# EAGLE design HammondWizard (EAGLE 9.5.2)
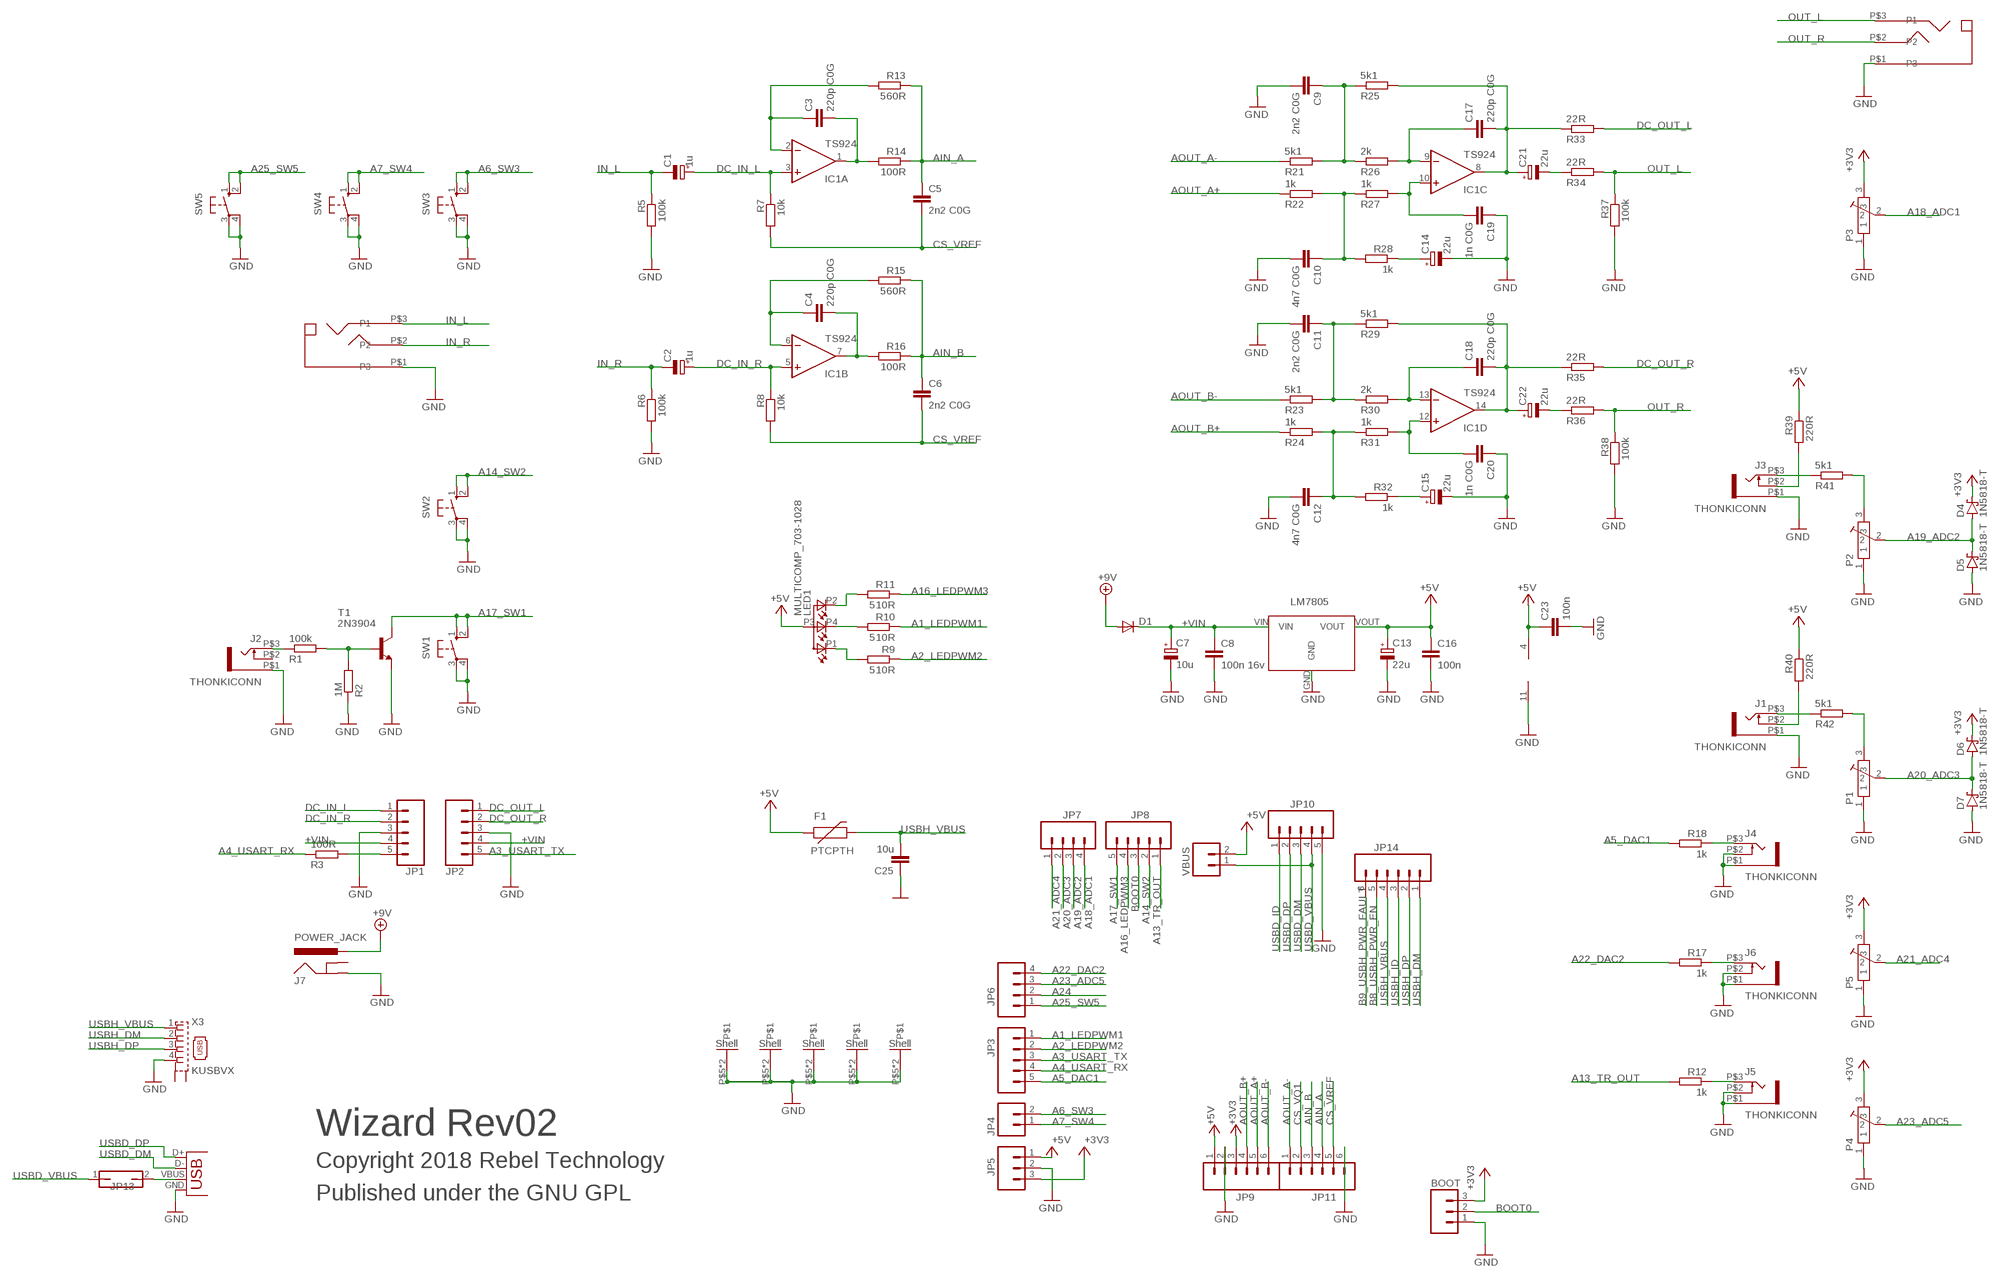
[diagram p0: schematic, sheet 1]

## Parts
BOOT  M03PTH  [1X03]
C1  1u  CPOL-EUE5-6  [E5-6]
C2  1u  CPOL-EUE5-6  [E5-6]
C3  220p C0G  C-EU050-024X044  [C050-024X044]
C4  220p C0G  C-EU050-024X044  [C050-024X044]
C5  2n2 C0G  C-EU050-024X044  [C050-024X044]
C6  2n2 C0G  C-EU050-024X044  [C050-024X044]
C7  10u  CPOL-EUE5-6  [E5-6]
C8  100n 16v  C-EU050-024X044  [C050-024X044]
C9  2n2 C0G  C-EU050-024X044  [C050-024X044]
C10  4n7 C0G  C-EU050-024X044  [C050-024X044]
C11  2n2 C0G  C-EU050-024X044  [C050-024X044]
C12  4n7 C0G  C-EU050-024X044  [C050-024X044]
C13  22u  CPOL-EUE5-6  [E5-6]
C14  22u  CPOL-EUE5-6  [E5-6]
C15  22u  CPOL-EUE5-6  [E5-6]
C16  100n  C-EU050-024X044  [C050-024X044]
C17  220p C0G  C-EU050-024X044  [C050-024X044]
C18  220p C0G  C-EU050-024X044  [C050-024X044]
C19  1n C0G  C-EU050-024X044  [C050-024X044]
C20  1n C0G  C-EU050-024X044  [C050-024X044]
C21  22u  CPOL-EUE5-6  [E5-6]
C22  22u  CPOL-EUE5-6  [E5-6]
C23  100n  C-EU050-024X044  [C050-024X044]
C25  10u  C-EU050-024X044  [C050-024X044]
D1  DIODE1N4001  [DIODE-1N4001]
D4  1N5818-T  [DO41-7.6]
D5  1N5818-T  [DO41-7.6]
D6  1N5818-T  [DO41-7.6]
D7  1N5818-T  [DO41-7.6]
F1  PTCPTH  [PTC]
IC1  TS924  LM324N  [DIL14]
J1  THONKICONN  [THONKICONN]
J2  THONKICONN  [THONKICONN]
J3  THONKICONN  [THONKICONN]
J4  THONKICONN  [THONKICONN]
J5  THONKICONN  [THONKICONN]
J6  THONKICONN  [THONKICONN]
J7  POWER_JACK  [DC_JACK_SLOT]
JP1  CONN_05JST-VERT  [JST-5-PTH-VERT]
JP2  CONN_05JST-VERT  [JST-5-PTH-VERT]
JP3  M05PTH  [1X05]
JP4  M02PTH  [1X02]
JP5  M03PTH  [1X03]
JP6  M04PTH  [1X04]
JP7  M04PTH  [1X04]
JP8  M05PTH  [1X05]
JP9  M06SIP  [1X06]
JP10  M05PTH  [1X05]
JP11  M06SIP  [1X06]
JP13  JP1Q  [JP1]
JP14  M06SIP  [1X06]
LED1  MULTICOMP_703-1028  [RGB-LED-703-1028]
P1  POT-ALPS-RK09L1140  [POT-ALPS-RK09L1140]
P2  POT-ALPS-RK09L1140  [POT-ALPS-RK09L1140]
P3  POT-ALPS-RK09L1140  [POT-ALPS-RK09L1140]
P4  POT-ALPS-RK09L1140  [POT-ALPS-RK09L1140]
P5  POT-ALPS-RK09L1140  [POT-ALPS-RK09L1140]
R1  100k  R-EU_0204/7  [0204/7]
R2  1M  R-EU_0204/7  [0204/7]
R3  100R  R-EU_0204/7  [0204/7]
R5  100k  R-EU_0204/7  [0204/7]
R6  100k  R-EU_0204/7  [0204/7]
R7  10k  R-EU_0204/7  [0204/7]
R8  10k  R-EU_0204/7  [0204/7]
R9  510R  R-EU_0204/7  [0204/7]
R10  510R  R-EU_0204/7  [0204/7]
R11  510R  R-EU_0204/7  [0204/7]
R12  1k  R-EU_0204/7  [0204/7]
R13  560R  R-EU_0204/7  [0204/7]
R14  100R  R-EU_0204/7  [0204/7]
R15  560R  R-EU_0204/7  [0204/7]
R16  100R  R-EU_0204/7  [0204/7]
R17  1k  R-EU_0204/7  [0204/7]
R18  1k  R-EU_0204/7  [0204/7]
R21  5k1  R-EU_0204/7  [0204/7]
R22  1k  R-EU_0204/7  [0204/7]
R23  5k1  R-EU_0204/7  [0204/7]
R24  1k  R-EU_0204/7  [0204/7]
R25  5k1  R-EU_0204/7  [0204/7]
R26  2k  R-EU_0204/7  [0204/7]
R27  1k  R-EU_0204/7  [0204/7]
R28  1k  R-EU_0204/7  [0204/7]
R29  5k1  R-EU_0204/7  [0204/7]
R30  2k  R-EU_0204/7  [0204/7]
R31  1k  R-EU_0204/7  [0204/7]
R32  1k  R-EU_0204/7  [0204/7]
R33  22R  R-EU_0204/7  [0204/7]
R34  22R  R-EU_0204/7  [0204/7]
R35  22R  R-EU_0204/7  [0204/7]
R36  22R  R-EU_0204/7  [0204/7]
R37  100k  R-EU_0204/7  [0204/7]
R38  100k  R-EU_0204/7  [0204/7]
R39  220R  R-EU_0204/7  [0204/7]
R40  220R  R-EU_0204/7  [0204/7]
R41  5k1  R-EU_0204/7  [0204/7]
R42  5k1  R-EU_0204/7  [0204/7]
SW1  10-XX  [B3F-10XX]
SW2  10-XX  [B3F-10XX]
SW3  10-XX  [B3F-10XX]
SW4  10-XX  [B3F-10XX]
SW5  10-XX  [B3F-10XX]
T1  2N3904  [TO92]
U2  LM7805  REG_S9V11F5  [REG_S9V11F5]
U$4  THONKICONN_STEREO  [THONKICONN_STEREO]
U$5  THONKICONN_STEREO  [THONKICONN_STEREO]
VBUS  M02PTH  [1X02]
X3  KUSBVX  [KUSBVX]
X5  USBPTH-VERTICAL  [USB-B-PTH-VERTICAL]

## Nets
+3V3: BOOT.3 D4.C D6.C JP5.3 JP9.3 P3.3 P4.3 P5.3
+5V: C13.+ C16.1 C23.1 F1.P$1 IC1.4(P:V+) JP5.1 JP9.1 LED1.P3(A) R39.1 R40.1 U2.VOUT VBUS.2
+9V: D1.A J7.PWR
+VIN: C7.+ C8.1 D1.C JP1.4 JP2.4 U2.VIN
A1_LEDPWM1: JP3.1 R10.1
A2_LEDPWM2: JP3.2 R9.1
A3_USART_TX: JP2.5 JP3.3
A4_USART_RX: JP3.4 R3.1
A5_DAC1: JP3.5 R18.2
A6_SW3: JP4.2 SW3.1(S) SW3.2(S1)
A7_SW4: JP4.1 SW4.1(S) SW4.2(S1)
A13_TR_OUT: JP8.1 R12.2
A14_SW2: JP8.2 SW2.1(S) SW2.2(S1)
A16_LEDPWM3: JP8.4 R11.1
A17_SW1: JP8.5 SW1.1(S) SW1.2(S1) T1.1(C)
A18_ADC1: JP7.4 P3.2
A19_ADC2: D4.A D5.C JP7.3 P2.2
A20_ADC3: D6.A D7.C JP7.2 P1.2
A21_ADC4: JP7.1 P5.2
A22_DAC2: JP6.4 R17.2
A23_ADC5: JP6.3 P4.2
A24: JP6.2
A25_SW5: JP6.1 SW5.1(S) SW5.2(S1)
AIN_A: C5.1 JP11.4 R13.1 R14.1
AIN_B: C6.1 JP11.3 R15.1 R16.1
AOUT_A+: JP9.5 R22.1
AOUT_A-: JP11.1 R21.1
AOUT_B+: JP9.4 R24.1
AOUT_B-: JP9.6 R23.1
B8_USBH_PWR_EN: JP14.5
B9_USBH_PWR_FAULT: JP14.6
BOOT0: BOOT.2 JP8.3
CS_VQ1: JP11.2
CS_VREF: C5.2 C6.2 JP11.5 R7.2 R8.2
DC_IN_L: C1.+ IC1.3(A:+IN) JP1.1 R7.1
DC_IN_R: C2.+ IC1.5(B:+IN) JP1.2 R8.1
DC_OUT_L: JP2.1 R33.2
DC_OUT_R: JP2.2 R35.2
GND: BOOT.1 C7.- C8.2 C9.2 C10.2 C11.2 C12.2 C13.- C14.- C15.- C16.2 C19.1 C20.1 C23.2 C25.1 D5.A D7.A IC1.11(P:V-) J1.P$1 J2.P$1 J3.P$1 J4.P$1 J4.P$2 J5.P$1 J5.P$2 J6.P$1 J6.P$2 J7.GND JP1.3 JP2.3 JP5.2 JP9.2 JP10.5 JP11.6 P1.1 P1.P$5 P1.P$6 P2.1 P2.P$5 P2.P$6 P3.1 P3.P$5 P3.P$6 P4.1 P4.P$5 P4.P$6 P5.1 P5.P$5 P5.P$6 R2.1 R5.2 R6.2 R37.2 R38.2 SW1.3(P) SW1.4(P1) SW2.3(P) SW2.4(P1) SW3.3(P) SW3.4(P1) SW4.3(P) SW4.4(P1) SW5.3(P) SW5.4(P1) T1.3(E) U2.GND U$4.P$1(P3) U$5.P$1(P3) X3.4 X5.GND
IN_L: C1.- R5.1 U$4.P$3(P1)
IN_R: C2.- R6.1 U$4.P$2(P2)
N$1: JP1.5 R3.2
N$2: J1.P$2 R40.2
N$3: C3.1 IC1.2(A:-IN) R13.2
N$4: C4.2 IC1.7(B:OUT) R16.2
N$5: C4.1 IC1.6(B:-IN) R15.2
N$6: C3.2 IC1.1(A:OUT) R14.2
N$7: C17.1 IC1.9(C:-IN) R26.2
N$8: C15.+ R32.1
N$9: C21.- R34.1
N$10: C14.+ R28.1
N$11: C19.2 IC1.10(C:+IN) R27.2
N$12: C18.2 C22.+ IC1.14(D:OUT) R29.2 R35.1
N$13: C22.- R36.1
N$14: LED1.P2(CGREEN) R11.2
N$15: C10.1 R22.2 R27.1 R28.2
N$16: LED1.P1(CRED) R9.2
N$17: LED1.P4(CBLUE) R10.2
N$18: JP13.2 X5.VBUS
N$19: J5.P$3 R12.1
N$20: J6.P$3 R17.1
N$21: J4.P$3 R18.1
N$22: J2.P$3 R1.1
N$23: J3.P$2 R39.2
N$24: C11.1 R23.2 R29.1 R30.1
N$25: P2.3 R41.2
N$26: C18.1 IC1.13(D:-IN) R30.2
N$27: J3.P$3 R41.1
N$30: C20.2 IC1.12(D:+IN) R31.2
N$31: P1.3 R42.2
N$32: C12.1 R24.2 R31.1 R32.2
N$33: J1.P$3 R42.1
N$37: R1.2 R2.2 T1.2(B)
N$39: C17.2 C21.+ IC1.8(C:OUT) R25.2 R33.1
N$41: C9.1 R21.2 R25.1 R26.1
OUT_L: R34.2 R37.1 U$5.P$3(P1)
OUT_R: R36.2 R38.1 U$5.P$2(P2)
USBD_DM: JP10.3 X5.D-
USBD_DP: JP10.2 X5.D+
USBD_ID: JP10.1
USBD_VBUS: JP10.4 JP13.1 VBUS.1
USBH_DM: JP14.1 X3.2
USBH_DP: JP14.2 X3.3
USBH_ID: JP14.3
USBH_VBUS: C25.2 F1.P$2 JP14.4 X3.1
Unconnected: J2.P$2 J7.GNDBREAK X3.M1(S1) X3.M2(S2)

## Notes on the sheet
- Wizard Rev02
- Copyright 2018 Rebel Technology
- Published under the GNU GPL

## Library data of the parts
BOOT JP5 = SparkFun:M03: Header 3 Standard 3-pin 0.1" header. Use with straight break away headers (SKU : PRT-00116), right angle break away headers (PRT-00553), swiss pins (PRT-00743), machine pins (PRT-00117), and female headers (PRT-00115). Molex polarized connector foot print use with SKU : PRT-08232 with associated crimp pins and housings.
C1 C2 C7 C13-C15 C21 C22 = Rebel:CPOL-EU: POLARIZED CAPACITOR, European symbol
C3-C6 C9-C12 C17-C20 C23 C25 = resistor:C-EU: CAPACITOR, European symbol
C8 C16 = Rebel:C-EU: CAPACITOR, European symbol
D1 = Rebel:DIODE: Diode These are standard reverse protection diodes and small signal diodes. SMA package can handle up to about 1A. SOD-323 can handle about 200mA. Watch the SOD-323 package when ordering, there are some mfgs out there that are 5-pin packages.
D4-D7 = diode:1N581*: 1.0A SCHOTTKY BARRIER RECTIFIER Source: http://www.diodes.com/datasheets/ds23001.pdf
F1 = Rebel:PTC: Resettable Fuse PTC Resettable Fuse. Bourns MF-R, Raychem PolySwitch RXE.
IC1 = linear:LM324: OP AMP
J1-J6 = Rebel:THONKICONN
J7 = Rebel:POWER_JACK: Power Jack This is the standard 5.5mm barrel jack for power. The PTH is the most common, proven, reliable, footprint. All others are experimental. The Slot footprint only works if the mill layer is transmitted to the PCB fab house so be warned. Spark Fun Electronics SKU : PRT-00119. Mating wall wart : TOL-00298 (and others)
JP1 JP2 = SparkFun-Connectors:CONN_05: Multi connection point. Often used as Generic Header-pin footprint for 0.1 inch spaced/style header connections On any of the 0.1 inch spaced packages, you can populate with these: Break Away Headers - Straight <https://www.sparkfun.com/products/116> (PRT-00116) Break Away Male Headers - Right Angle <https://www.sparkfun.com/products/553> (PRT-00553) Female Headers <https://www.sparkfun.com/products/115> (PRT-00115) Break Away Headers - Machine Pin <https://www.sparkfun.com/products/117> (PRT-00117) Break Away Female Headers - Swiss Machine Pin <https://www.sparkfun.com/products/743> (PRT-00743) For SCREWTERMINALS and SPRING TERMINALS visit here: Screw Terimnals on SparkFun.com <https://www.sparkfun.com/search/results?term=Screw+Terminals> (5mm/3.5mm/2.54mm spacing) This device is also useful as a general connection point to wire up your design to another part of your project. Our various solder wires solder well into these plated through hole pads. Hook-Up Wire - Assortment (Stranded, 22 AWG) <https://www.sparkfun.com/products/11375> (PRT-11375) Hook-Up Wire - Assortment (Solid Core, 22 AWG) <https://www.sparkfun.com/products/11367> (PRT-11367) View the entire wire category on our website here <https://www.sparkfun.com/categories/141> Special notes: Molex polarized connector foot print use with SKU : PRT-08231 with associated crimp pins and housings. 1MM SMD Version SKU: PRT-10208
JP3 JP8 JP10 = SparkFun:M05: Header 5 Standard 5-pin 0.1" header. Use with straight break away headers (SKU : PRT-00116), right angle break away headers (PRT-00553), swiss pins (PRT-00743), machine pins (PRT-00117), and female headers (PRT-00115). Molex polarized connector foot print use with SKU : PRT-08230 with associated crimp pins and housings.
JP4 VBUS = SparkFun:M02: Header 2 Standard 2-pin 0.1" header. Use with straight break away headers (SKU : PRT-00116), right angle break away headers (PRT-00553), swiss pins (PRT-00743), machine pins (PRT-00117), and female headers (PRT-00115). Molex polarized connector foot print use with SKU : PRT-08233 with associated crimp pins and housings.
JP6 JP7 = SparkFun:M04: Header 4 Standard 4-pin 0.1" header. Use with straight break away headers (SKU : PRT-00116), right angle break away headers (PRT-00553), swiss pins (PRT-00743), machine pins (PRT-00117), and female headers (PRT-00115). Molex polarized connector foot print use with SKU : PRT-08231 with associated crimp pins and housings. 1MM SMD Version SKU: PRT-10208
JP9 JP11 JP14 = SparkFun:M06: Header 6 Standard 6-pin 0.1" header. Use with straight break away headers (SKU : PRT-00116), right angle break away headers (PRT-00553), swiss pins (PRT-00743), machine pins (PRT-00117), and female headers (PRT-00115). Molex polarized connector foot print use with SKU : PRT-08094 with associated crimp pins and housings. NOTES ON THE VARIANTS LOCK and LOCK_LONGPADS... This footprint was designed to help hold the alignment of a through-hole component (i.e. 6-pin header) while soldering it into place. You may notice that each hole has been shifted either up or down by 0.005 of an inch from it's more standard position (which is a perfectly straight line). This slight alteration caused the pins (the squares in the middle) to touch the edges of the holes. Because they are alternating, it causes a "brace" to hold the component in place. 0.005 has proven to be the perfect amount of "off-center" position when using our standard breakaway headers. Although looks a little odd when you look at the bare footprint, once you have a header in there, the alteration is very hard to notice. Also, if you push a header all the way into place, it is covered up entirely on the bottom side. This idea of altering the position of holes to aid alignment will be further integrated into the Sparkfun Library for other footprints. It can help hold any component with 3 or more connection pins.
JP13 = jumper:JP1Q: JUMPER
LED1 = Rebel:MULTICOMP_703-1028: Farnell: 2112143
P1-P5 = Rebel:POT-ALPS-RK09L
R1-R3 R5-R18 R21-R42 = Rebel:R-EU_: RESISTOR, European symbol
SW1-SW5 = switch-omron:10-XX: OMRON SWITCH; MPN: B3F-1000; OC_FARNELL: 176432; OC_NEWARK: 36M3542
T1 = transistor-npn:2N3904: NPN Transistor
U2 = Rebel:REG_S9V11F5
U$4 U$5 = Rebel:THONKICONN_STEREO
X3 = con-kycon:KUSBVX: Vertical,Top Entry Universal Serial Bus Connector KUSBVX Series Source: KYCON Sibalco USB vertical socket KUSBV.pdf
X5 = SparkFun:USB: USB Connectors USB-B-PTH is fully proven SKU : PRT-00139 USB-miniB is fully proven SKU : PRT-00587 USB-A-PCB is untested. USB-A-H is throughly reviewed, but untested. Spark Fun Electronics SKU : PRT-00437 USB-B-SMT is throughly reviewed, but untested. Needs silkscreen touching up. USB-A-S has not been used/tested USB-MB-H has not been used/tested

## Net classes
1 power: width 0.178 mm, drill 0.305 mm, clearance 0.178 mm to class 0, clearance 0.178 mm

## Board
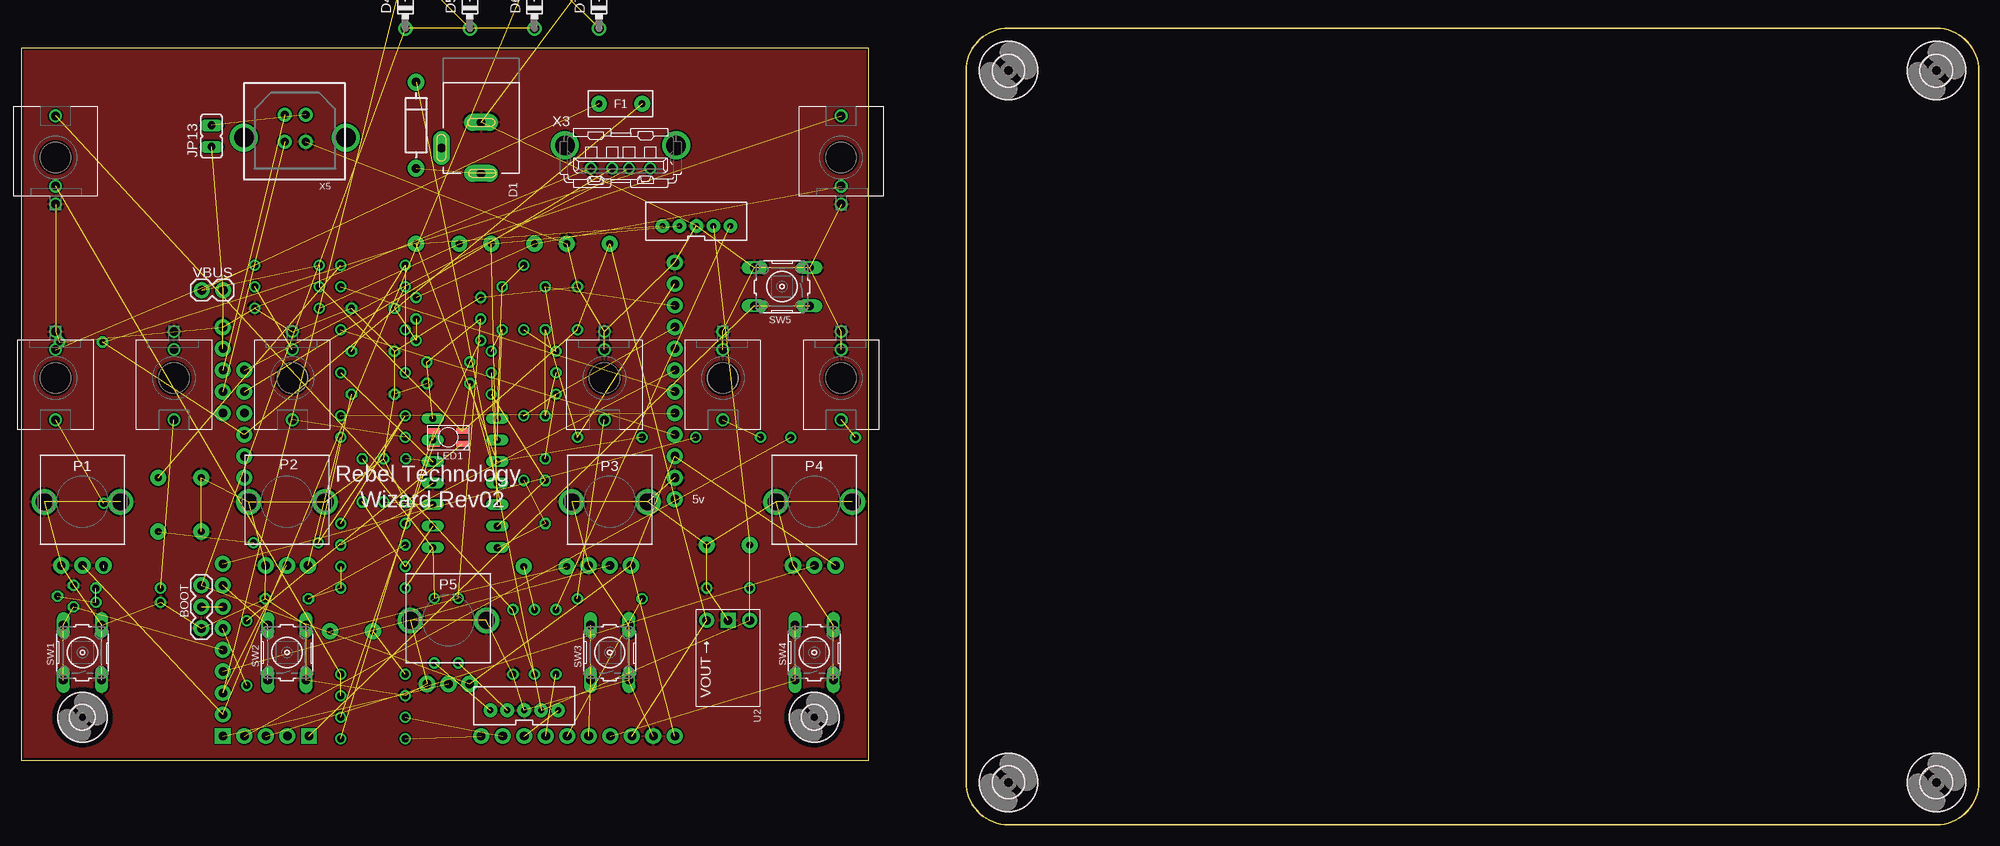
[diagram p1: board, top side]
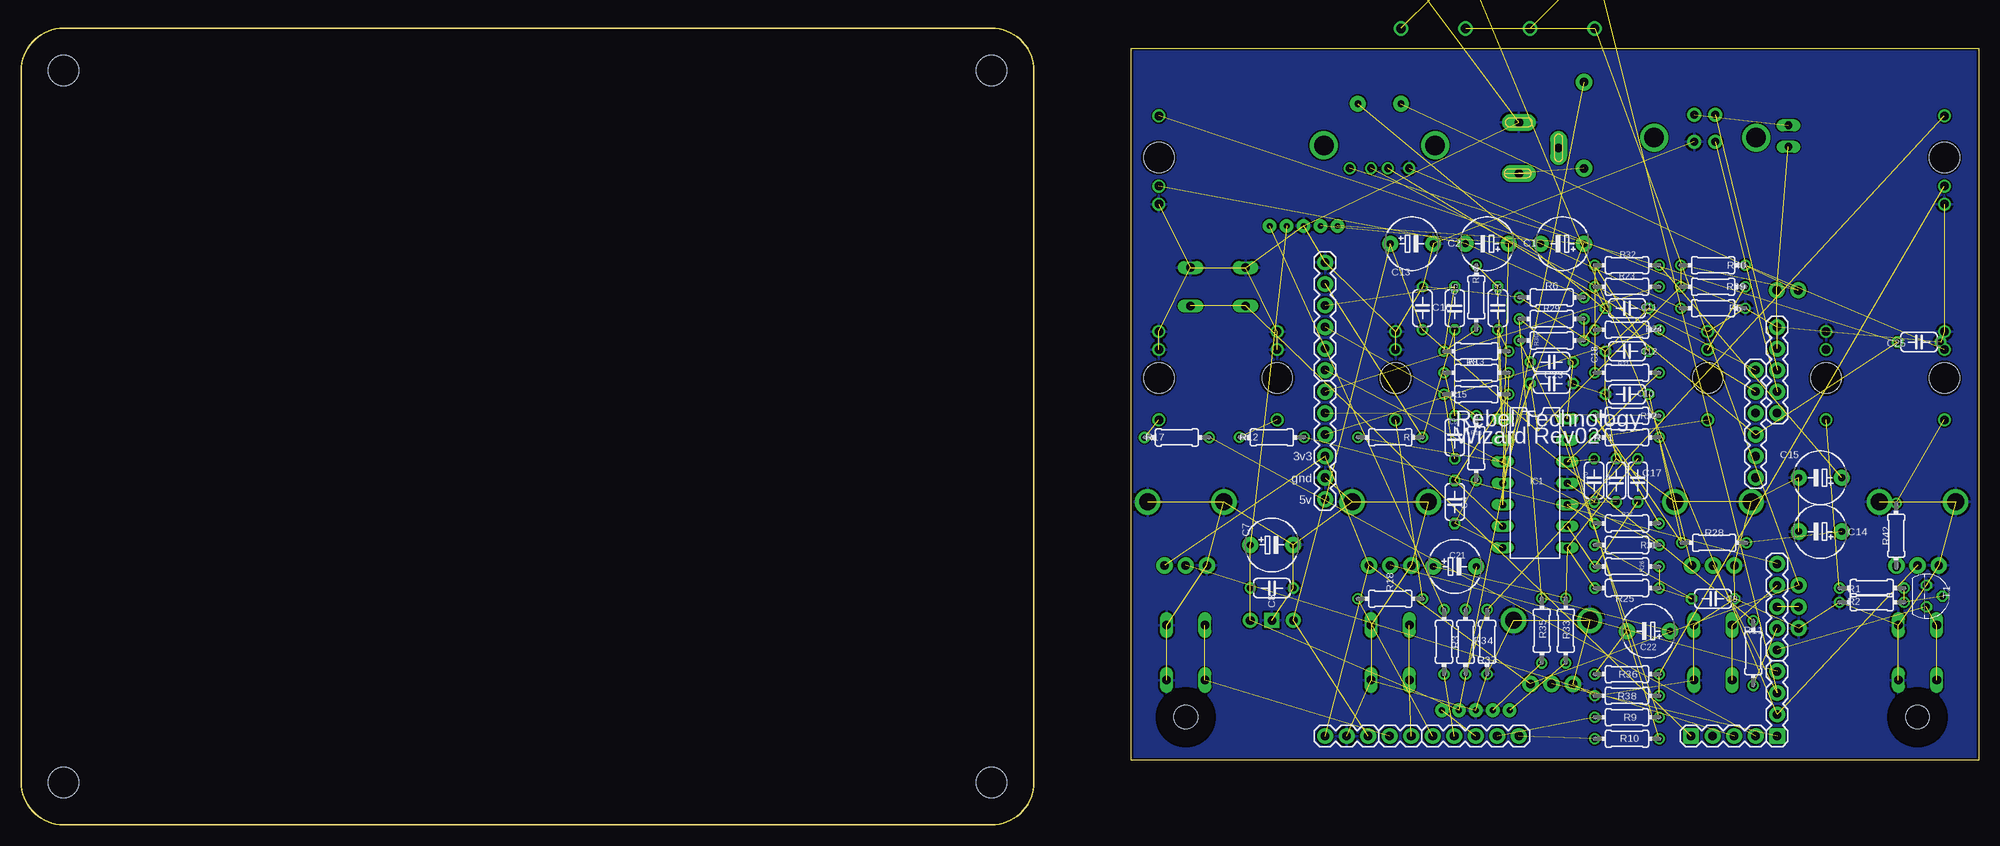
[diagram p2: board, bottom side, seen from below]

Size 231.01 x 94 mm. Coordinates in mm from the lower left corner, seen from the top.
Outline: 100,91.62 0,91.62 0,7.62 100,7.62 100,91.62
Outline: 226.01,0 116.51,0 arc-90 111.51,5 111.51,89 arc-90 116.51,94 226.01,94 arc-90 231.01,89 231.01,5 arc-90 226.01,0
Copper layers (1*16): Top 0.035mm / dielectric 1.5mm / Bottom 0.035mm
Design rules "Fusion_eagle_rule_v1.1": minimum track width 6mil, minimum drill 12mil, track to track 6mil, track to pad 6mil, pad to pad 6mil, via to via 6mil, smd to smd 0mil, copper to edge 10mil, drill to drill 10mil, minimum pad ring 10mil, minimum via ring 6mil, stop-mask expansion 2mil, vias tented up to drill 100mil, thermal gap 10mil

### Footprints (pad centres in the part's own frame; a part is rotated, then mirrored left to right if it is on the bottom)
1X03 = drill 1.016 pad 1.88: 1 0,0; 2 2.54,0; 3 5.08,0
E5-6 = drill 0.813 pad 1.905: + -2.54,0; - 2.54,0
C050-024X044 = drill 0.813 octagon: 1 -2.54,0; 2 2.54,0
C050-024X044' = drill 0.813: 1 -2.54,0; 2 2.54,0
DIODE-1N4001 = drill 1 pad 1.981: A -5.08,0; C 5.08,0
DO41-7.6 = drill 1.1 pad 1.7: A 3.81,0; C -3.81,0
PTC = drill 0.8 pad 1.88: P$1 -2.54,0; P$2 2.54,0
DIL14 = drill 0.813 long: 1 -7.62,-3.81; 2 -5.08,-3.81; 3 -2.54,-3.81; 4 0,-3.81; 5 2.54,-3.81; 6 5.08,-3.81; 7 7.62,-3.81; 8 7.62,3.81; 9 5.08,3.81; 10 2.54,3.81; 11 0,3.81; 12 -2.54,3.81; 13 -5.08,3.81; 14 -7.62,3.81
THONKICONN = drill 1: P$1 0,-5.5; P$2 0,-3.38; P$3 0,4.92 | hole 3.6: 0,0
DC_JACK_SLOT = drill 1 pad 2 long: GND 0,4.743; GNDBREAK 4.697,7.742; PWR 0,10.749
JST-5-PTH-VERT = drill 0.7 pad 1.6: 1 -4,0.18; 2 -2,0.18; 3 0,0.18; 4 2,0.18; 5 4,0.18
1X05 = drill 1.016 pad 1.88: 1 0,0; 2 2.54,0; 3 5.08,0; 4 7.62,0; 5 10.16,0
1X02 = drill 1.016 pad 1.88: 1 0,0; 2 2.54,0
1X04 = drill 1.016 pad 1.88 square: 1 0,0 | drill 1.016 pad 1.88: 2 2.54,0; 3 5.08,0; 4 7.62,0
1X06 = drill 1.016 pad 1.88: 1 0,0; 2 2.54,0; 3 5.08,0; 4 7.62,0; 5 10.16,0; 6 12.7,0
JP1 = drill 0.914 long: 1 0,-1.27; 2 0,1.27
RGB-LED-703-1028 = smd 0.7 x 1.4: P1 -0.75,1.65; P2 -0.75,-1.65; P3 0.75,-1.65; P4 0.75,1.65
POT-ALPS-RK09L1140 = drill 1 pad 1.93: 1 -2.5,-7.5; 2 0,-7.5; 3 2.5,-7.5 | drill 2: P$5 -4.5,0; P$6 4.5,0
0204/7 = drill 0.813: 1 -3.81,0; 2 3.81,0
B3F-10XX = drill 1.016 long: 1 -3.251,2.261; 2 3.251,2.261; 3 -3.251,-2.261; 4 3.251,-2.261
TO92 = drill 0.813 octagon: 1 1.27,0; 2 0,1.905; 3 -1.27,0
REG_S9V11F5 = drill 1.016 pad 1.778 square: GND 0,0 | drill 1.016 pad 1.778: VIN -2.54,0; VOUT 2.54,0
2,8 = hole 2.8: 0,0
THONKICONN_STEREO = drill 1: P$1 0,-5.5; P$2 0,-3.38; P$3 0,4.92 | hole 3.6: 0,0
3,6 = hole 3.6: 0,0
KUSBVX = drill 0.9 pad 1.3: 1 3.5,0; 2 1,0; 3 -1,0; 4 -3.5,0 | drill 2.3 pad 2.8: M1 -6.57,2.71; M2 6.57,2.71
USB-B-PTH-VERTICAL = drill 0.914 pad 1.676: D+ 4.826,4.394; D- 4.826,7.595; GND 7.315,4.394; VBUS 7.315,7.595 | drill 2.286: P$1 0,4.902; P$2 12.04,4.902

### Placement (x,y rotation side)
BOOT  21.26,23.18 90 top
C1  49.14,68.58 180 bottom
C2  58.03,68.58 180 bottom
C3  56.76,60.96 90 bottom
C4  61.84,38.1 270 bottom
C5  61.84,60.96 270 bottom
C6  61.84,45.72 90 bottom
C7  83.43,33.02 0 bottom
C8  100n 16v  [C050-024X044']  83.43,27.94 0 bottom
C9  31.36,26.67 0 bottom
C10  41.52,50.8 180 bottom
C11  41.52,60.96 0 bottom
C12  41.52,55.88 180 bottom
C13  66.92,68.58 0 bottom
C14  18.72,34.61 180 bottom
C15  18.72,40.96 180 bottom
C16  100n  [C050-024X044']  65.65,60.96 90 bottom
C17  40.25,40.64 90 bottom
C18  50.41,54.61 0 bottom
C19  42.79,40.64 270 bottom
C20  45.39,40.64 90 bottom
C21  61.84,30.48 0 bottom
C22  38.98,22.86 180 bottom
C23  50.41,52.07 0 bottom
C25  7.06,56.97 180 bottom
D1  46.6,82.55 90 top
D4  45.33,97.79 90 top
D5  52.95,97.79 90 top
D6  60.57,97.79 90 top
D7  68.19,97.79 90 top
F1  70.73,85.09 0 top
IC1  52.38,40.32 270 bottom
J1  4.05,52.7 180 top
J2  18.02,52.7 180 top
J3  31.99,52.7 180 top
J4  68.82,52.7 180 top
J5  82.79,52.7 180 top
J6  96.76,52.7 180 top
J7  54.28,87.63 180 top
JP1  79.68,70.48 0 top
JP2  59.36,13.34 0 top
JP3  54.28,10.48 180 bottom
JP4  69.52,10.48 0 bottom
JP5  72.06,10.48 180 bottom
JP6  33.96,10.48 0 bottom
JP7  23.8,10.48 90 bottom
JP8  23.8,30.8 270 bottom
JP9  77.14,38.42 90 bottom
JP10  23.8,48.58 90 bottom
JP11  77.14,53.66 90 bottom
JP13  22.47,81.28 0 top
JP14  26.34,53.66 270 bottom
LED1  50.41,45.72 90 top
P1  7.23,38.1 0 top
P2  31.36,38.1 0 top
P3  69.46,38.1 0 top
P4  93.59,38.1 0 top
P5  50.41,24.13 0 top
R1  12.63,27.94 0 bottom
R2  12.63,26.27 0 bottom
R3  63.11,21.59 90 bottom
R5  31.36,60.96 0 bottom
R6  50.41,62.23 180 bottom
R7  69.46,45.72 0 bottom
R8  59.3,53.34 180 bottom
R9  41.52,12.7 0 bottom
R10  41.52,10.16 0 bottom
R11  26.61,20.26 90 bottom
R12  83.43,45.72 0 bottom
R13  59.3,55.88 0 bottom
R14  59.3,62.23 90 bottom
R15  59.3,50.8 0 bottom
R16  59.3,44.45 270 bottom
R17  94.64,45.71 0 bottom
R18  69.46,26.67 180 bottom
R21  41.52,33.02 180 bottom
R22  41.52,48.26 180 bottom
R23  41.52,63.5 180 bottom
R24  41.52,58.42 180 bottom
R25  41.52,27.94 180 bottom
R26  41.52,30.48 180 bottom
R27  41.52,35.56 180 bottom
R28  31.23,33.27 180 bottom
R29  50.41,59.69 180 bottom
R30  50.41,57.15 180 bottom
R31  41.52,53.34 0 bottom
R32  41.52,66.04 180 bottom
R33  48.73,22.91 270 bottom
R34  60.57,21.59 270 bottom
R35  51.56,22.91 270 bottom
R36  41.52,17.78 0 bottom
R37  58.03,21.59 270 bottom
R38  41.52,15.24 180 bottom
R39  31.36,63.5 0 bottom
R40  31.36,66.04 0 bottom
R41  41.52,45.72 0 bottom
R42  9.76,34.12 270 bottom
SW1  7.23,20.32 90 top
SW2  31.36,20.32 90 top
SW3  69.46,20.32 90 top
SW4  93.59,20.32 90 top
SW5  89.78,63.5 180 top
T1  6.18,26.98 270 bottom
U2  83.43,24.13 180 top
U$1  [2,8]  7.23,12.7 0 top
U$2  [2,8]  93.59,12.7 0 top
U$4  96.76,78.74 0 top
U$5  4.05,78.74 0 top
U$6  [3,6]  116.51,5 0 top
U$7  [3,6]  116.51,89 0 top
U$8  [3,6]  226.01,89 0 top
U$9  [3,6]  226.01,5 0 top
VBUS  23.84,63.08 180 top
X3  70.73,77.47 0 top
X5  26.28,76.2 0 top

### Tracks (layer width: path | path; a pad name or v marks a point on that pad's centre or on a via)
+3V3  (7 unrouted)
+5V  (11 unrouted)
+9V  (1 unrouted)
+VIN  (5 unrouted)
A1_LEDPWM1  (1 unrouted)
A2_LEDPWM2  (1 unrouted)
A3_USART_TX  (1 unrouted)
A4_USART_RX  (1 unrouted)
A5_DAC1  (1 unrouted)
A6_SW3  (2 unrouted)
A7_SW4  (2 unrouted)
A13_TR_OUT  (1 unrouted)
A14_SW2  (2 unrouted)
A16_LEDPWM3  (1 unrouted)
A17_SW1  (3 unrouted)
A18_ADC1  (1 unrouted)
A19_ADC2  (3 unrouted)
A20_ADC3  (3 unrouted)
A21_ADC4  (1 unrouted)
A22_DAC2  (1 unrouted)
A23_ADC5  (1 unrouted)
A25_SW5  (2 unrouted)
AIN_A  (3 unrouted)
AIN_B  (3 unrouted)
AOUT_A+  (1 unrouted)
AOUT_A-  (1 unrouted)
AOUT_B+  (1 unrouted)
AOUT_B-  (1 unrouted)
BOOT0  (1 unrouted)
CS_VREF  (4 unrouted)
DC_IN_L  (3 unrouted)
DC_IN_R  (3 unrouted)
DC_OUT_L  (1 unrouted)
DC_OUT_R  (1 unrouted)
GND  (69 unrouted)
  pour Bottom: -13.03,6.35 -13.03,100.33 103.81,100.33 103.81,6.35
  pour Top: -11.76,5.08 -11.76,101.6 105.08,101.6 105.08,5.08
IN_L  (2 unrouted)
IN_R  (2 unrouted)
N$1  (1 unrouted)
N$2  (1 unrouted)
N$3  (2 unrouted)
N$4  (2 unrouted)
N$5  (2 unrouted)
N$6  (2 unrouted)
N$7  (2 unrouted)
N$8  (1 unrouted)
N$9  (1 unrouted)
N$10  (1 unrouted)
N$11  (2 unrouted)
N$12  (4 unrouted)
N$13  (1 unrouted)
N$14  (1 unrouted)
N$15  (3 unrouted)
N$16  (1 unrouted)
N$17  (1 unrouted)
N$18  (1 unrouted)
N$19  (1 unrouted)
N$20  (1 unrouted)
N$21  (1 unrouted)
N$22  (1 unrouted)
N$23  (1 unrouted)
N$24  (3 unrouted)
N$25  (1 unrouted)
N$26  (2 unrouted)
N$27  (1 unrouted)
N$30  (2 unrouted)
N$31  (1 unrouted)
N$32  (3 unrouted)
N$33  (1 unrouted)
N$37  (2 unrouted)
N$39  (4 unrouted)
N$41  (3 unrouted)
OUT_L  (2 unrouted)
OUT_R  (2 unrouted)
USBD_DM  (1 unrouted)
USBD_DP  (1 unrouted)
USBD_VBUS  (2 unrouted)
USBH_DM  (1 unrouted)
USBH_DP  (1 unrouted)
USBH_VBUS  (3 unrouted)

### Text on the board
tPlace: Rebel Technology | Wizard Rev02 | 5v
bPlace: Rebel Technology | Wizard Rev02 | 3v3 | gnd | 5v